# Altium schematic sheet ledDriverSchematic.SchDoc: SchematicLedDriver
size A4; Date: 10/03/2021; SheetNumber: 1; SheetTotal: 1
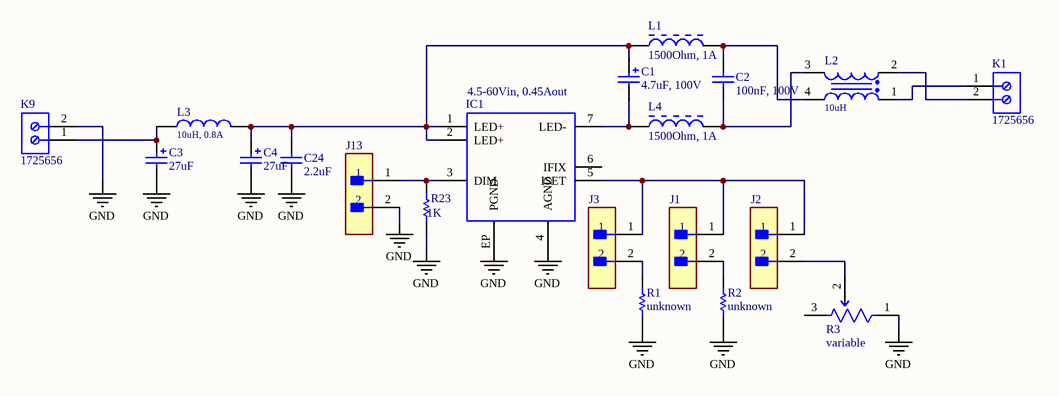
[diagram p0: ledDriverSchematic.SchDoc]

## Parts
C1  4.7uF, 100V  [WCAP-PSLP_D6.3H7.7]
C2  100nF, 100V  [WCAP-CSGP_0805_H=1.25mm]
C3  27uF  [WCAP-ATUL_D8H11.5]
C4  27uF  [WCAP-ATUL_D8H11.5]
C24  2.2uF  [CAPC1210(3225)280_N]
IC1  4.5-60Vin, 0.45Aout  [172946001]
J1  (no value)  [FP-TSW-102-07-G-S-MFG]
J2  (no value)  [FP-TSW-102-07-G-S-MFG]
J3  (no value)  [FP-TSW-102-07-G-S-MFG]
J13  (no value)  [FP-TSW-102-07-G-S-MFG]
K1  1725656  [PHOE-1725656-2]
K9  1725656  [PHOE-1725656-2]
L1  1500Ohm, 1A  [WE-CBF_0805_High Current]
L2  10uH  [WE-SL2]
L3  10uH, 0.8A  [WE-PD2_3521]
L4  1500Ohm, 1A  [WE-CBF_0805_High Current]
R1  unknown  [VISH-A1-2_V2]
R2  unknown  [VISH-A1-2_V2]
R3  variable  [FP-3361P-MFG]
R23  1K  [RESC2013X60X30ML20T20]

## Nets
GND: C3.2(N) C4.2(N) C24.1 IC1.4(AGND) IC1.EP(PGND) J13.2 K9.2 R1.1 R2.1 R3.1(CCW) R23.1
NetC1_1: C1.1(P) C4.1(P) C24.2 IC1.1(LED+) IC1.2(LED+) L1.1 L3.2
NetC1_2: C1.2(N) IC1.7(LED-) L4.1
NetC2_1: C2.1 L2.3 L4.2
NetC2_2: C2.2 L1.2 L2.4
NetC3_1: C3.1(P) K9.1 L3.1
NetIC1_3: IC1.3(DIM) J13.1 R23.2
NetIC1_5: IC1.5(ISET) J1.1 J2.1 J3.1
NetJ1_2: J1.2 R2.2
NetJ2_2: J2.2 R3.2(WIPER)
NetJ3_2: J3.2 R1.2
NetK1_1: K1.1 L2.1
NetK1_2: K1.2 L2.2

Not connected (* = marked no-connect by the designer): IC1 6(IFIX); R3 3(CW)

## Library data of the parts
C1 = 875105945001: WCAP-PSLP Aluminum Polymer Capacitor, V-Chip, SMT, D6.3xH7.7mm, 4.7uF, 100V; Manufacturer: Wurth Elektronik; Ripple Current: 1060mA; Technical Reference: PSED0774R7M100DVCTCB000; Capacitance Tolerance: +/-20%; Dissipation Factor: 12%; Rated Voltage: 100VDC; Leakage Current: 600uA; ESR: 100mOhm; Endurance: 2000h; ComponentLink1URL: http://www.we-online.de; ComponentLink1Description: Manufacturer; Capacitance: 4.7uF; Diameter: 6.3mm; Published Date: October 2020; Packaging: Tape and Reel; Operating Temperature: -55 to +105degC; Mounting Technology: SMT; Manufacturer Part Number: 875105945001; Height: 7.7mm; ComponentLink2URL: https://www.we-online.com/catalog/datasheet/875105945001.pdf; ComponentLink2Description: Datasheet
C2 = 885012207128: WCAP-CSGP Multilayer Ceramic Chip Capacitor, General Purpose, size 0805, X7R, 100nF, 100V; Manufacturer: Wurth Elektronik; Rated Voltage: 100VDC; Isolation Resistance: >=1GOhm; Capacitance Tolerance: +/-10%; Technical Reference: X7R0805104K100DFCT10000; ComponentLink1Description: Manufacturer; ComponentLink1URL: http://www.we-online.de; ComponentLink2Description: Datasheet; ComponentLink2URL: https://www.we-online.com/catalog/datasheet/885012207128.pdf; Operating Temperature: -55 to +125degC; Packaging: Tape and Reel; Manufacturer Part Number: 885012207128; Published Date: May 2020; Ceramic Type: X7R; Dissipation Factor: =<2.5%; Height: 1.25mm; Mounting Technology: SMT; Size: 0805; Capacitance: 100nF
C3 C4 = 860040874001: WCAP-ATUL Aluminum Electrolytic Capacitor, Radial, THT, D8xH11.5mm, 27uF, 100V; Manufacturer: Wurth Elektronik; Ripple Current: 300mA; Technical Reference: ATDE115270M100DSPA7G000; Capacitance Tolerance: +/-20%; Rated Voltage: 100VDC; Leakage Current: 27uA; Endurance: 7000h; Dissipation Factor: 9%; Capacitance: 27uF; ComponentLink1URL: http://www.we-online.de; ComponentLink1Description: Manufacturer; Published Date: October 2020; Packaging: Ammo Pack; Operating Temperature: -40 to +105degC; Mounting Technology: THT; Manufacturer Part Number: 860040874001; Height: 11.5mm; Diameter: 8mm; ComponentLink2URL: https://www.we-online.com/catalog/datasheet/860040874001.pdf; ComponentLink2Description: Datasheet
C24 = CMP-1038-02104-1: CAP 2.2uF 100V ±10% 1210 (3225 Metric) Thickness 2.8mm SMD; Case-Metric: 3225; Tolerance: Â±10%; Case-EIA: 1210; Rated Voltage: 100 V; Value: 2.2uF; Technology: SMT; Max Thickness: 2.8 mm
IC1 = 172946001: MagI3C-LDHM LED Step Down High Current Module, TO263-7EP, 4.5-60Vin, 0.45Aout; Output Current: 0.45A; ComponentLink1Description: Manufacturer; ComponentLink1URL: http://www.we-online.de; ComponentLink2Description: Datasheet; ComponentLink2URL: https://katalog.we-online.de/pm/datasheet/172946001.pdf; Input Voltage: 4.5-60V; Mounting Technology: SMT; Packaging: Tape and Reel; Output Voltage: 4.5-60V; Operating Temperature: -40 to +125degC; Publisher: Wurth Elektronik; Published Date: October 2019; Part Number: 172946001; Size: TO263-7EP
J1-J3 J13 = CMP-02766-000084-1: CONN HEADER VERT 2POS 2.54MM; Manufacturer: Samtec; Manufacturer Part Number: TSW-102-07-G-S; Number Of Contacts: 2; Voltage Rating: 550V; Conn Orientation: Straight; Current Rating: 6.3A; Conn Gender: Male; Package: TSW-102-07-G-S; Digikey Description: CONN HEADER VERT 2POS 2.54MM; ComponentLink2URL: http://suddendocs.samtec.com/catalog_english/tsw_th.pdf; Height: 8.71mm; Temperature: -55°C to +125°C; Device Class L2: Headers and Wire Housings; ComponentLink2Description: Datasheet; Device Class L3: unset; Contact Material: Gold,Nickel; Temperature Range Low: -55°C; Temperature Range High: +125°C; RoHS: TRUE; Device Class L1: Connectors; Mouser Description: Conn Unshrouded Header HDR 2 POS 2.54mm Solder ST Thru-Hole Automotive Bulk; Number Of Rows: 1; Category: Conn; Pitch: 2.54mm; Lead Free: Yes; Automotive: No; Footprint Url: http://suddendocs.samtec.com/prints/tsw-xxx-xx-x-x-xx-xxx-footprint.pdf; Octopart: https://octopart.com/tsw-102-07-g-s-samtec-272197
K1 K9 = CMP-2000-05299-1: Male Header, Pitch 2.54 mm, 1 x 2 Position, Height 9 mm, Tail Length 3.5 mm; Manufacturer: Phoenix Contact; Number of contacts: 2; Content: 250pc(s); Pitch: 2.54mm; Industrial packaging: Yes; Colour: Green; Manufacturer part No.: 1725656; Type: MPT0,5/2-2,54; Datasheet URL: http://datasheet.octopart.com/1725656-Phoenix-Contact-datasheet-5302866.pdf; Manufacturer URL: http://www.phoenixcontact.com/; Datasheet Version: Apr-08
L1 L4 = 742792097: WE-CBF SMT EMI Suppression Ferrite Bead, size 0805, 1500Ohm, 1A; Manufacturer: Wurth Elektronik; Impedance max.: 1800Ohm; DC Resistance max.: 0.3Ohm; Type: High Current; ComponentLink1Description: Manufacturer; ComponentLink1URL: http://www.we-online.de; ComponentLink2Description: Datasheet; ComponentLink2URL: https://www.we-online.com/catalog/datasheet/742792097.pdf; Operating Temperature: -55 to +125degC; Packaging: Tape and Reel; Published Date: March 2020; Rated Current: 1A; Manufacturer Part Number: 742792097; Impedance @100MHz: 1500Ohm; Mounting Technology: SMT; Size: 0805
L2 = 744226S: WE-SL2 SMT Common Mode Line Filter, 10uH, 1.6A, 80V; Manufacturer: Wurth Elektronik; Impedance max.: 920Ohm; DC Resistance max.: 0.08Ohm; Insulation Test Voltage: 500VAC; Winding Style: sectional; ComponentLink1Description: Manufacturer; ComponentLink1URL: http://www.we-online.de; ComponentLink2Description: Datasheet; ComponentLink2URL: https://www.we-online.com/catalog/datasheet/744226S.pdf; Packaging: Tape and Reel; Published Date: April 2020; Rated Current: 1.6A; Mounting Technology: SMT; Manufacturer Part Number: 744226S; Operating Temperature: -40 to +125degC; Inductance: 10uH; Rated Voltage: 80V
L3 = 7447732110: WE-PD2 SMT Power Inductor, size 3521, 10uH, 0.8A; Manufacturer: Wurth Elektronik; Self Resonant Frequency: 45MHz; DC Resistance max.: 0.3Ohm; DC Resistance typ.: 0.237Ohm; Saturation Current: 1.23A; ComponentLink1Description: Manufacturer; ComponentLink1URL: http://www.we-online.de; ComponentLink2Description: Datasheet; ComponentLink2URL: https://www.we-online.com/catalog/datasheet/7447732110.pdf; Packaging: Tape and Reel; Published Date: April 2020; Rated Current: 0.8A; Operating Temperature: -40 to +125degC; Size: 3521; Inductance: 10uH; Mounting Technology: SMT; Manufacturer Part Number: 7447732110
R1 R2 = CMP-1240-00001-1: Power Metal Film Leaded Resistor, 62 KOhm +/-5%, 2 W, 2-Pin THD, RoHS, Ammo Pack; PartNumber: PR02000206202JA100; Manufacturer: Vishay Semiconductor; Resistance: 62 KOhm; Temperature Coefficient: +/-250 ppm/degC; Power: 2 W; ComponentLink2URL: http://www.vishay.com/docs/28729/28729.pdf; Mounting Technology: Through Hole; Tolerance: +/-5%; ComponentLink3Description: Package Specification; ComponentLink3URL: http://www.vishay.com/docs/28729/28729.pdf; ComponentLink1Description: Manufacturer URL; ComponentLink2Description: Datasheet; DatasheetVersion: Jun-13; PackageDescription: 2-Pin Axial Lead, Body 10 x 3.9 mm; ComponentLink1URL: http://www.vishay.com/; Packing: Ammo Pack; RoHS: TRUE
R3 = CMP-07234-000005-1: TRIMMER 5K OHM 0.5W GW TOP ADJ; Manufacturer: Bourns; Manufacturer Part Number: 3361P-1-502GLF; Temperature Coefficient: 100ppm/°C; Tolerance: 10%; Resistance: 5kΩ; Value: 5kΩ; Voltage Rating: 300V; Lead Free: Yes; Power Rating: 0.5W; Automotive: No; Temperature Range Low: -55°C; ComponentLink2URL: https://www.bourns.com/docs/product-datasheets/3361.pdf?sfvrsn=3426000b_8; Device Class L2: Resistors; Series: 3361; Octopart: https://octopart.com/3361p-1-502glf-bourns-92301; Temperature Range High: +125°C; Composition: Cermet; Height: 5.84mm; RoHS: TRUE; Device Class L1: Passive Components; Mouser Description: Trimmer Resistors - SMD 1/4" SQ 5K 10% 0.5WATTS; Package: 3361P; Category: Res; ComponentLink2Description: Datasheet; Digikey Description: TRIMMER 5K OHM 0.5W GW TOP ADJ; Device Class L3: Variable Resistors and Potentiometers; Temperature: -55°C to +125°C
R23 = CMP-2001-04656-1: Part Number: RK73B2ATTD102J; Manufacturer: KOA Speer